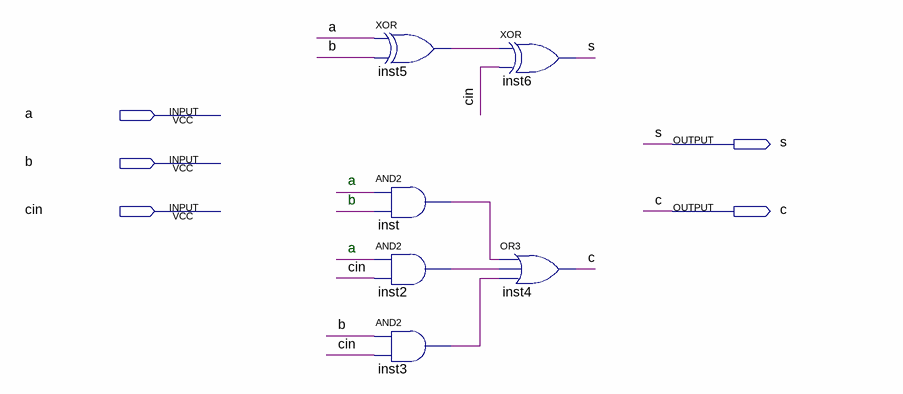
[diagram p0: schematic sheet]
// Quartus schematic FA.bdf as structural Verilog: 6 symbols, 5 pins
module FA (
  input  a,
  input  b,
  input  cin,
  output s,
  output c
);

  wire inst2_out, inst3_out, inst5_out, inst_out;

  xor inst5 (inst5_out, a, b);
  and inst (inst_out, a, b);
  and inst2 (inst2_out, a, cin);
  and inst3 (inst3_out, b, cin);
  xor inst6 (s, inst5_out, cin);
  or inst4 (c, inst_out, inst2_out, inst3_out);

  // Notes on the sheet:
  //   a
  //   b
  //   a
endmodule
